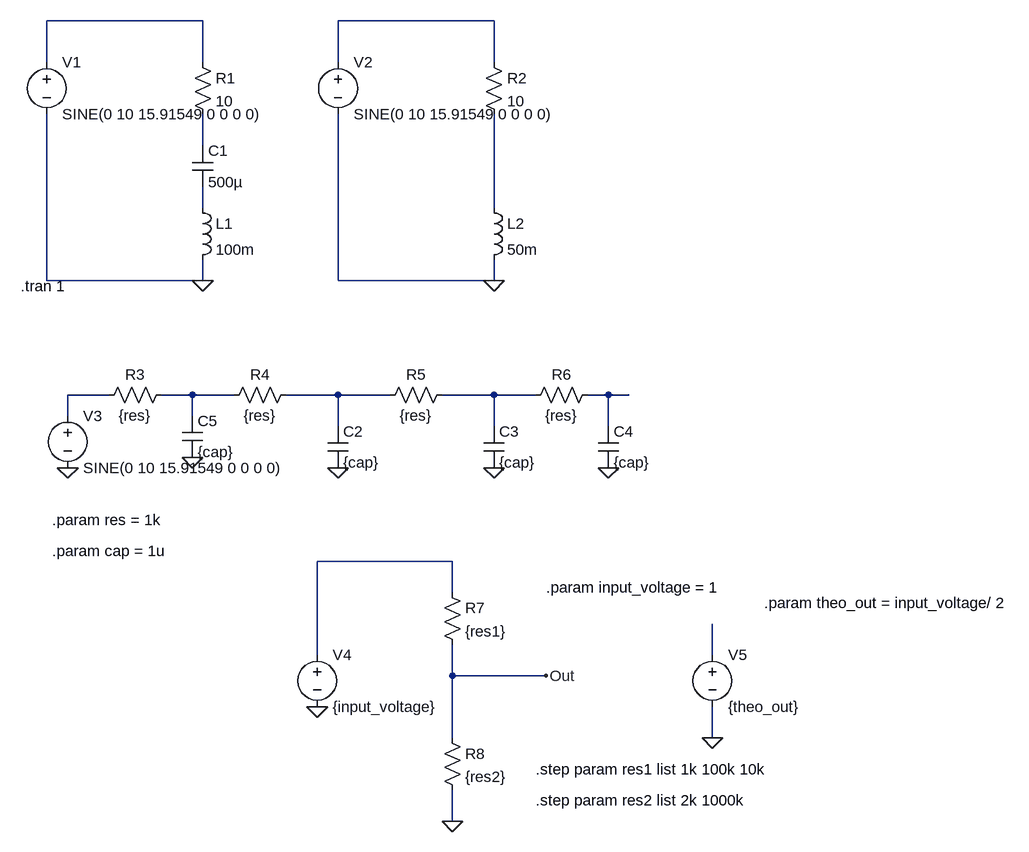
[diagram p0: schematic Draft1.asc]
Draft1.asc, the LTspice schematic file:
Version 4.1
SHEET 1 1640 1332
WIRE 352 80 112 80
WIRE 800 80 560 80
WIRE 112 144 112 80
WIRE 352 144 352 80
WIRE 560 144 560 80
WIRE 800 144 800 80
WIRE 352 272 352 224
WIRE 352 368 352 336
WIRE 800 368 800 224
WIRE 112 480 112 224
WIRE 352 480 352 448
WIRE 352 480 112 480
WIRE 560 480 560 224
WIRE 800 480 800 448
WIRE 800 480 560 480
WIRE 208 656 144 656
WIRE 336 656 288 656
WIRE 400 656 336 656
WIRE 560 656 480 656
WIRE 640 656 560 656
WIRE 800 656 720 656
WIRE 864 656 800 656
WIRE 976 656 944 656
WIRE 1008 656 976 656
WIRE 144 688 144 656
WIRE 336 688 336 656
WIRE 560 704 560 656
WIRE 800 704 800 656
WIRE 976 704 976 656
WIRE 736 912 528 912
WIRE 736 960 736 912
WIRE 528 1056 528 912
WIRE 1136 1056 1136 1008
WIRE 736 1088 736 1040
WIRE 880 1088 736 1088
WIRE 736 1184 736 1088
WIRE 1136 1184 1136 1136
WIRE 736 1312 736 1264
FLAG 352 480 0
FLAG 800 480 0
FLAG 144 768 0
FLAG 336 752 0
FLAG 560 768 0
FLAG 800 768 0
FLAG 976 768 0
FLAG 528 1136 0
FLAG 736 1312 0
FLAG 880 1088 Out
FLAG 1136 1184 0
SYMBOL voltage 112 128 R0
WINDOW 123 0 0 Left 0
WINDOW 39 0 0 Left 0
SYMATTR InstName V1
SYMATTR Value SINE(0 10 15.91549 0 0 0 0)
SYMBOL res 336 128 R0
SYMATTR InstName R1
SYMATTR Value 10
SYMBOL cap 336 272 R0
SYMATTR InstName C1
SYMATTR Value 500µ
SYMBOL ind 336 352 R0
SYMATTR InstName L1
SYMATTR Value 100m
SYMBOL voltage 560 128 R0
WINDOW 123 0 0 Left 0
WINDOW 39 0 0 Left 0
SYMATTR InstName V2
SYMATTR Value SINE(0 10 15.91549 0 0 0 0)
SYMBOL res 784 128 R0
SYMATTR InstName R2
SYMATTR Value 10
SYMBOL ind 784 352 R0
SYMATTR InstName L2
SYMATTR Value 50m
SYMBOL voltage 144 672 R0
WINDOW 123 0 0 Left 0
WINDOW 39 0 0 Left 0
SYMATTR InstName V3
SYMATTR Value SINE(0 10 15.91549 0 0 0 0)
SYMBOL res 304 640 R90
WINDOW 0 0 56 VBottom 2
WINDOW 3 32 56 VTop 2
SYMATTR InstName R3
SYMATTR Value {res}
SYMBOL cap 320 688 R0
SYMATTR InstName C5
SYMATTR Value {cap}
SYMBOL res 496 640 R90
WINDOW 0 0 56 VBottom 2
WINDOW 3 32 56 VTop 2
SYMATTR InstName R4
SYMATTR Value {res}
SYMBOL cap 544 704 R0
SYMATTR InstName C2
SYMATTR Value {cap}
SYMBOL res 736 640 R90
WINDOW 0 0 56 VBottom 2
WINDOW 3 32 56 VTop 2
SYMATTR InstName R5
SYMATTR Value {res}
SYMBOL cap 784 704 R0
SYMATTR InstName C3
SYMATTR Value {cap}
SYMBOL cap 960 704 R0
SYMATTR InstName C4
SYMATTR Value {cap}
SYMBOL res 960 640 R90
WINDOW 0 0 56 VBottom 2
WINDOW 3 32 56 VTop 2
SYMATTR InstName R6
SYMATTR Value {res}
SYMBOL voltage 528 1040 R0
WINDOW 123 0 0 Left 0
WINDOW 39 0 0 Left 0
SYMATTR InstName V4
SYMATTR Value {input_voltage}
SYMBOL res 720 944 R0
SYMATTR InstName R7
SYMATTR Value {res1}
SYMBOL res 720 1168 R0
SYMATTR InstName R8
SYMATTR Value {res2}
SYMBOL voltage 1136 1040 R0
WINDOW 123 0 0 Left 0
WINDOW 39 0 0 Left 0
SYMATTR InstName V5
SYMATTR Value {theo_out}
TEXT 72 488 Left 2 !.tran 1
TEXT 120 848 Left 2 !.param res = 1k
TEXT 120 896 Left 2 !.param cap = 1u
TEXT 880 952 Left 2 !.param input_voltage = 1
TEXT 1216 976 Left 2 !.param theo_out = input_voltage/ 2
TEXT 864 1232 Left 2 !.step param res1 list 1k 100k 10k
TEXT 864 1280 Left 2 !.step param res2 list 2k 1000k

The netlist it stands for:
* Draft1.asc
V1 N001 0 SINE(0 10 15.91549 0 0 0 0)
R1 N001 N003 10
C1 N003 N004 500µ
L1 N004 0 100m
V2 N002 0 SINE(0 10 15.91549 0 0 0 0)
R2 N002 N005 10
L2 N005 0 50m
V3 N006 0 SINE(0 10 15.91549 0 0 0 0)
R3 N007 N006 {res}
C5 N007 0 {cap}
R4 N008 N007 {res}
C2 N008 0 {cap}
R5 N009 N008 {res}
C3 N009 0 {cap}
C4 N010 0 {cap}
R6 N010 N009 {res}
V4 N011 0 {input_voltage}
R7 N011 Out {res1}
R8 Out 0 {res2}
V5 N012 0 {theo_out}
.tran 1
.param res = 1k
.param cap = 1u
.param input_voltage = 1
.param theo_out = input_voltage/ 2
.step param res1 list 1k 100k 10k
.step param res2 list 2k 1000k
.backanno
.end